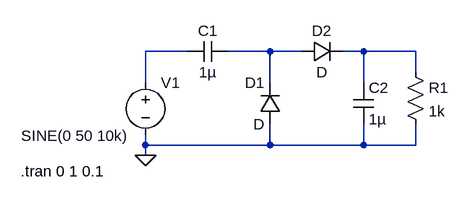
[diagram p0: schematic ex1.asc]
ex1.asc, the LTspice schematic file:
Version 4
SHEET 1 880 680
WIRE -96 -64 -160 -64
WIRE 32 -64 -32 -64
WIRE 80 -64 32 -64
WIRE 176 -64 144 -64
WIRE 256 -64 176 -64
WIRE 256 -32 256 -64
WIRE -160 -16 -160 -64
WIRE 32 -16 32 -64
WIRE 176 -16 176 -64
WIRE -160 80 -160 64
WIRE 32 80 32 48
WIRE 32 80 -160 80
WIRE 176 80 176 48
WIRE 176 80 32 80
WIRE 256 80 256 48
WIRE 256 80 176 80
WIRE -160 96 -160 80
FLAG -160 96 0
SYMBOL voltage -160 -32 R0
WINDOW 3 -191 98 Left 2
WINDOW 123 0 0 Left 0
WINDOW 39 0 0 Left 0
SYMATTR InstName V1
SYMATTR Value SINE(0 50 10k)
SYMBOL cap -32 -80 R90
WINDOW 0 0 32 VBottom 2
WINDOW 3 32 32 VTop 2
SYMATTR InstName C1
SYMATTR Value 1µ
SYMBOL cap 160 -16 R0
SYMATTR InstName C2
SYMATTR Value 1µ
SYMBOL diode 48 48 R180
WINDOW 0 24 64 Left 2
WINDOW 3 24 0 Left 2
SYMATTR InstName D1
SYMBOL diode 80 -48 R270
WINDOW 0 32 32 VTop 2
WINDOW 3 0 32 VBottom 2
SYMATTR InstName D2
SYMBOL res 240 -48 R0
SYMATTR InstName R1
SYMATTR Value 1k
TEXT -352 120 Left 2 !.tran 0 1 0.1

The netlist it stands for:
* ex1.asc
V1 N001 0 SINE(0 50 10k)
C1 N002 N001 1µ
C2 N003 0 1µ
D1 0 N002 D
D2 N002 N003 D
R1 N003 0 1k
.model D D
.lib standard.dio
.tran 0 1 0.1
.backanno
.end